# EAGLE design simpleROM (EAGLE 8.1.0)
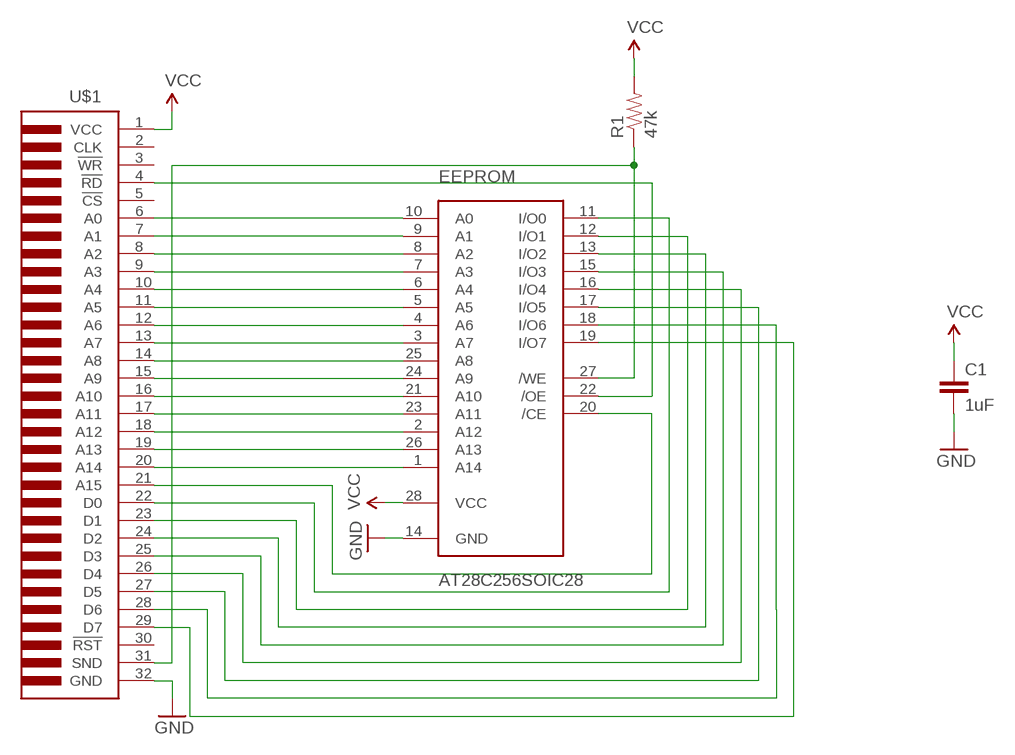
[diagram p0: schematic, sheet 1]

## Parts
C1  1uF  SPARKFUN-CAPACITORS_CAP1206  [SPARKFUN-CAPACITORS_1206]
EEPROM  AT28C256SOIC28  [SO28]
R1  47k  SPARKFUN-RESISTORS_RESISTOR1206  [SPARKFUN-RESISTORS_1206]
U$1  GBCART-FULL  [GBCART]

## Nets
/CE: EEPROM.20(/CE) U$1.21(A15)
/OE: EEPROM.22(/OE) U$1.4(!RD)
/WE: EEPROM.27(/WE) R1.1 U$1.31(SND)
GND: C1.2 EEPROM.14(GND) U$1.32(GND)
N$1: EEPROM.10(A0) U$1.6(A0)
N$2: EEPROM.9(A1) U$1.7(A1)
N$3: EEPROM.8(A2) U$1.8(A2)
N$4: EEPROM.7(A3) U$1.9(A3)
N$5: EEPROM.6(A4) U$1.10(A4)
N$6: EEPROM.5(A5) U$1.11(A5)
N$7: EEPROM.4(A6) U$1.12(A6)
N$8: EEPROM.3(A7) U$1.13(A7)
N$9: EEPROM.25(A8) U$1.14(A8)
N$10: EEPROM.24(A9) U$1.15(A9)
N$11: EEPROM.21(A10) U$1.16(A10)
N$12: EEPROM.23(A11) U$1.17(A11)
N$13: EEPROM.2(A12) U$1.18(A12)
N$14: EEPROM.26(A13) U$1.19(A13)
N$15: EEPROM.1(A14) U$1.20(A14)
N$16: EEPROM.19(I/O7) U$1.29(D7)
N$17: EEPROM.18(I/O6) U$1.28(D6)
N$22: EEPROM.11(I/O0) U$1.22(D0)
N$23: EEPROM.12(I/O1) U$1.23(D1)
N$24: EEPROM.13(I/O2) U$1.24(D2)
N$25: EEPROM.15(I/O3) U$1.25(D3)
N$26: EEPROM.16(I/O4) U$1.26(D4)
N$27: EEPROM.17(I/O5) U$1.27(D5)
VCC: C1.1 EEPROM.28(VCC) R1.2 U$1.1(VCC)
Unconnected: U$1.2(CLK) U$1.3(!WR) U$1.5(!CS) U$1.30(!RST)

## Library data of the parts
C1 = Mega8515_flasher:SPARKFUN-CAPACITORS_CAP: Capacitor Standard 0603 ceramic capacitor, and 0.1" leaded capacitor.
EEPROM = gameboy:AT28C256
R1 = Mega8515_flasher:SPARKFUN-RESISTORS_RESISTOR: Resistor Basic schematic elements and footprints for 0603, 1206, and PTH resistors.
U$1 = gameboy:GBCART

## Net classes
0 default: width 0.152 mm, drill 0.4 mm, clearance 0.152 mm

## Board
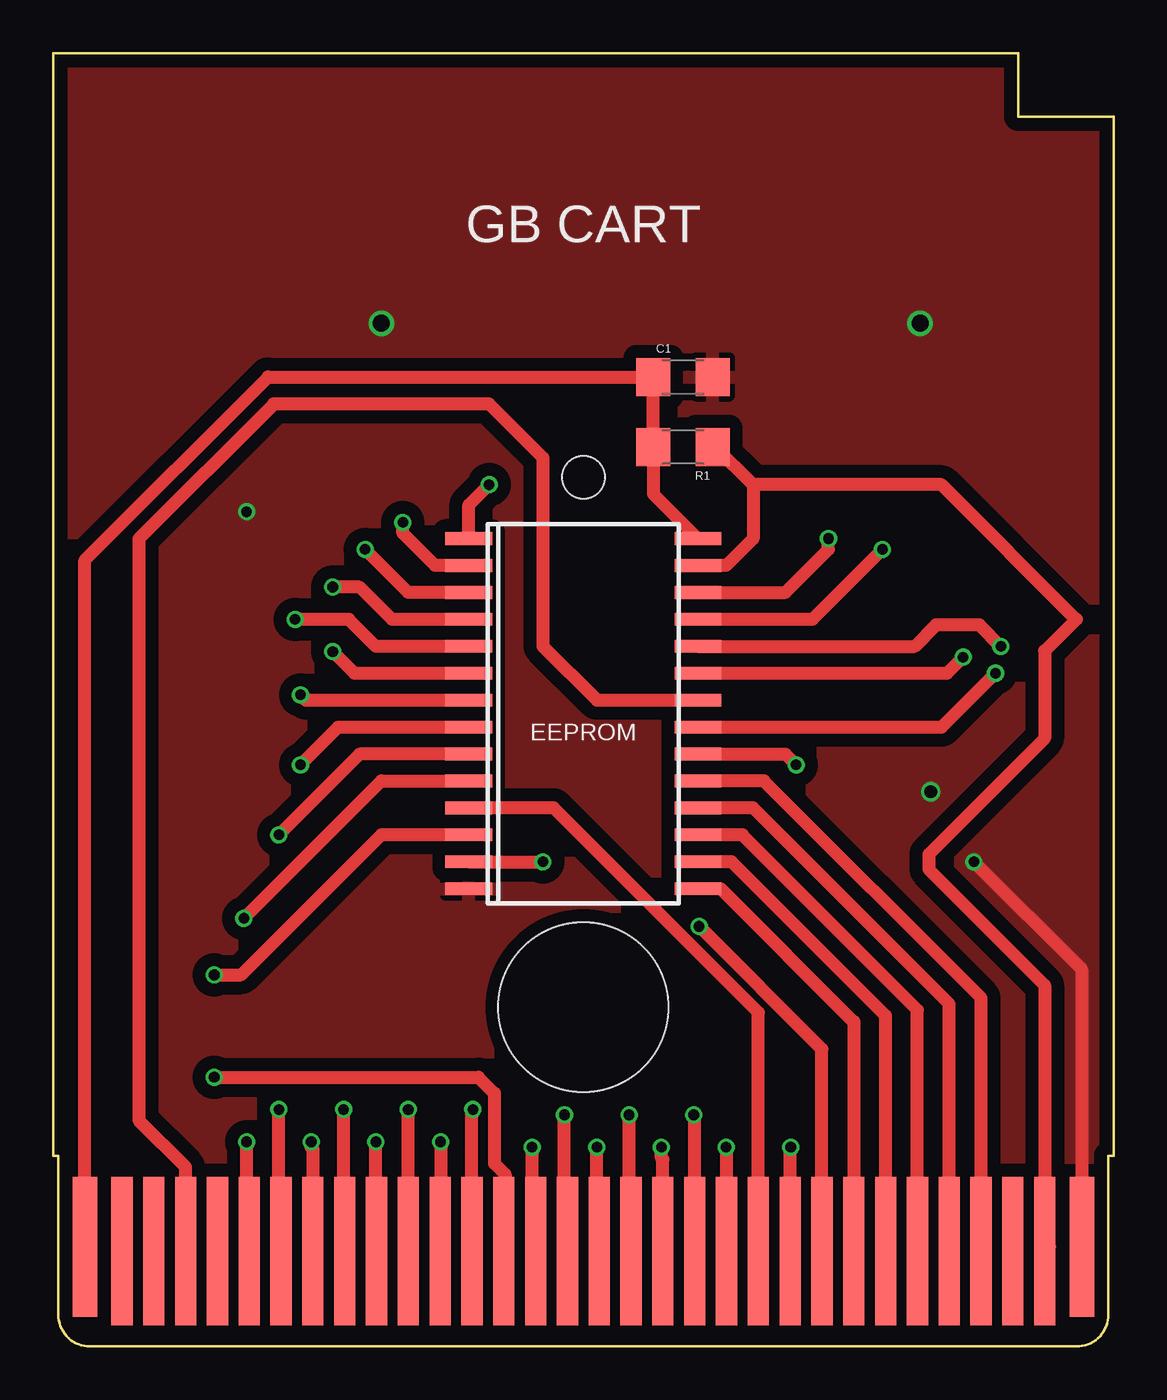
[diagram p1: board, top side]
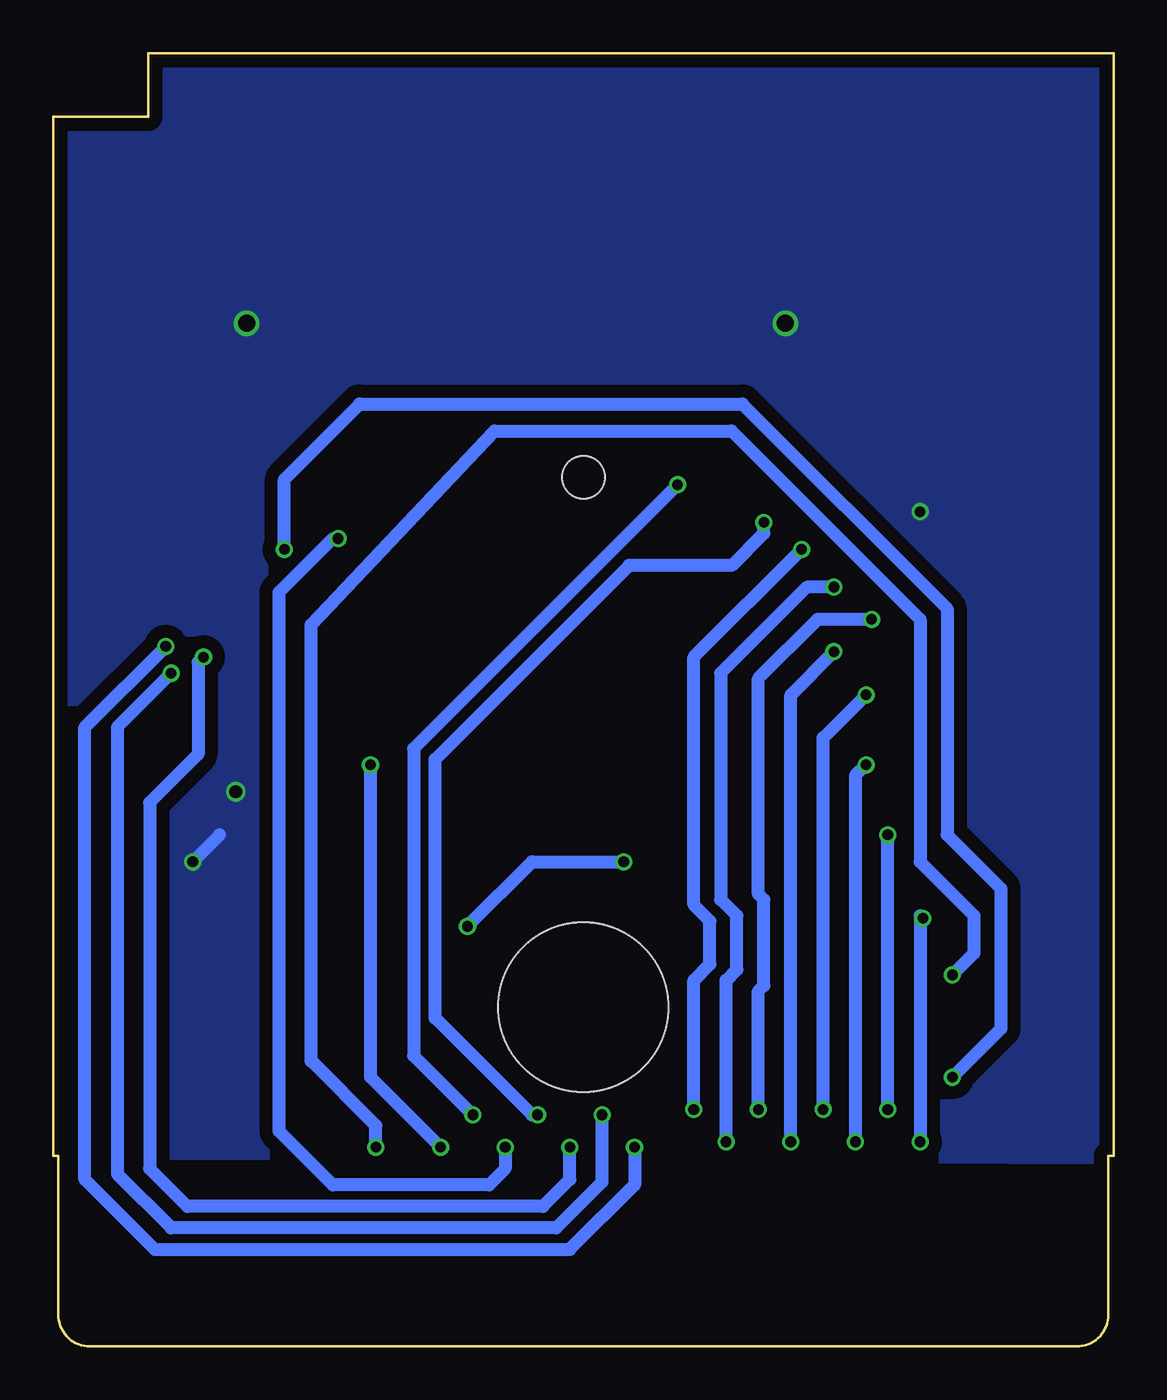
[diagram p2: board, bottom side, seen from below]

Size 50 x 61 mm. Coordinates in mm from the lower left corner, seen from the top.
Copper layers (1*16): Top 0.035mm / dielectric 1.6mm / Bottom 0.035mm
Design rules "Elecrow_2-layer_PCB_eagle_rule": minimum track width 6mil, minimum drill 12mil, track to track 6mil, track to pad 6mil, pad to pad 6mil, via to via 8mil, smd to smd 0mil, copper to edge 20mil, drill to drill 10mil, minimum pad ring 6mil, minimum via ring 6mil, stop-mask expansion 0mil, vias tented up to drill 100mil, thermal gap 10mil

### Footprints (pad centres in the part's own frame; a part is rotated, then mirrored left to right if it is on the bottom)
SPARKFUN-CAPACITORS_1206 = smd 1.6 x 1.8: 1 -1.4,0; 2 1.4,0
SO28 = smd 0.6 x 2.2: 1 -8.255,-5.4; 2 -6.985,-5.4; 3 -5.715,-5.4; 4 -4.445,-5.4; 5 -3.175,-5.4; 6 -1.905,-5.4; 7 -0.635,-5.4; 8 0.635,-5.4; 9 1.905,-5.4; 10 3.175,-5.4; 11 4.445,-5.4; 12 5.715,-5.4; 13 6.985,-5.4; 14 8.255,-5.4; 15 8.255,5.4; 16 6.985,5.4; 17 5.715,5.4; 18 4.445,5.4; 19 3.175,5.4; 20 1.905,5.4; 21 0.635,5.4; 22 -0.635,5.4; 23 -1.905,5.4; 24 -3.175,5.4; 25 -4.445,5.4; 26 -5.715,5.4; 27 -6.985,5.4; 28 -8.255,5.4
SPARKFUN-RESISTORS_1206 = smd 1.6 x 1.8: 1 -1.4,0; 2 1.4,0
GBCART = smd 1.15 x 6.604: 1 -23.5,-24.51; 32 23.5,-24.51 | smd 1 x 7: 2 -21.75,-24.71; 3 -20.25,-24.71; 4 -18.75,-24.71; 5 -17.25,-24.71; 6 -15.75,-24.71; 7 -14.25,-24.71; 8 -12.75,-24.71; 9 -11.25,-24.71; 10 -9.75,-24.71; 11 -8.25,-24.71; 12 -6.75,-24.71; 13 -5.25,-24.71; 14 -3.75,-24.71; 15 -2.25,-24.71; 16 -0.75,-24.71; 17 0.75,-24.71; 18 2.25,-24.71; 19 3.75,-24.71; 20 5.25,-24.71; 21 6.75,-24.71; 22 8.25,-24.71; 23 9.75,-24.71; 24 11.25,-24.71; 25 12.75,-24.71; 26 14.25,-24.71; 27 15.75,-24.71; 28 17.25,-24.71; 29 18.75,-24.71; 30 20.25,-24.71; 31 21.75,-24.71 | hole 8: 0,-13.21 | hole 2: 0,11.79

### Placement (x,y rotation side)
C1  29.7,45.72 0 top
EEPROM  25,29.84 270 top
R1  29.7,42.42 180 top
U$1  25,29.21 0 top

### Tracks (layer width: path | path; a pad name or v marks a point on that pad's centre or on a via)
/CE  (via drill 0.5)
  Top 0.61: U$1.21 31.75,9.38 v31.73,9.4 | EEPROM.20 34.52,27.94 v35.03,27.43
  Bottom 0.61: v31.73,9.4 35.03,12.7 v35.03,27.43
/OE
  Top 0.61: U$1.4 6.25,8.46 4.05,10.67 4.05,38.1 10.4,44.45 20.56,44.45 23.1,41.91 23.1,33.02 25.64,30.48 EEPROM.22
/WE
  Top 0.61: EEPROM.27 31.73,36.83 33,38.1 33,40.64 | R1.1 31.22,42.42 33,40.64 | 46.97,4.72 U$1.31 46.75,17.04 41.29,22.5 41.29,23.22 46.75,28.68 46.75,32.8 48.24,34.29 41.89,40.64 33,40.64
GND  (via drill 0.5, 0.6, 0.8)
  Top 0.61: U$1.32 48.5,4.5 48.5,7.62 48.5,17.78 v43.41,22.86
  Bottom 0.61: v43.41,22.86 42.15,24.13
  other vias: 9.13,39.37 15.48,48.26 40.88,48.26 41.38,26.16
  pour Top (isolate 0.61): 49.77,8.89 -0.02,8.89 -0.02,60.96 49.77,60.96
  pour Bottom (isolate 0.61): 0.24,62.23 50.02,62.48 50.02,9.14 -0.02,8.89
N$1  (via drill 0.5)
  Top 0.61: v9,20.19 15.48,26.67 EEPROM.10 | U$1.6 9.38,4.63 9.13,4.88 v9.13,9.65
  Bottom 0.61: v9,20.19 9.13,20.32 v9.13,9.65
N$2  (via drill 0.5)
  Top 0.61: EEPROM.9 14.46,27.94 v10.65,24.13 | U$1.7 10.65,4.6 v10.65,11.18
  Bottom 0.61: v10.65,11.18 v10.65,24.13
N$3  (via drill 0.5)
  Top 0.61: v11.67,27.43 13.44,29.21 EEPROM.8 | U$1.8 12.25,9.32 12.17,9.4 v12.17,9.65
  Bottom 0.61: v11.67,27.43 12.17,26.92 v12.17,9.65
N$4  (via drill 0.5)
  Top 0.61: U$1.9 13.7,4.55 v13.7,11.18 | v11.67,30.73 11.92,30.48 EEPROM.7
  Bottom 0.61: v13.7,11.18 13.7,28.7 v11.67,30.73
N$5  (via drill 0.5)
  Top 0.61: U$1.10 15.22,4.53 v15.22,9.65 | v13.19,32.77 14.21,31.75 EEPROM.6
  Bottom 0.61: v15.22,9.65 15.22,30.73 v13.19,32.77
N$6  (via drill 0.5)
  Top 0.61: U$1.11 v16.75,11.18 | EEPROM.5 15.22,33.02 13.95,34.29 v11.41,34.29
  Bottom 0.61: v11.41,34.29 13.95,34.29 16.75,31.5 16.75,21.34 16.49,21.08 16.49,17.02 16.75,16.76 v16.75,11.18
N$7  (via drill 0.5)
  Top 0.61: EEPROM.4 15.98,34.29 14.46,35.81 v13.19,35.81 | v18.27,9.65 18.27,4.52 U$1.12
  Bottom 0.61: v13.19,35.81 14.46,35.81 18.52,31.75 18.52,21.08 17.76,20.32 17.76,17.78 18.27,17.27 v18.27,9.65
N$8  (via drill 0.5)
  Top 0.61: EEPROM.3 16.75,35.56 v14.71,37.59 | U$1.13 19.75,10.88 v19.79,11.18
  Bottom 0.61: v14.71,37.59 19.79,32.51 19.79,20.83 19.03,20.07 19.03,18.03 19.79,17.27 v19.79,11.18
N$9  (via drill 0.5)
  Top 0.61: EEPROM.25 35.8,34.29 v39.1,37.59 | U$1.14 21.32,4.57 21.32,8.13 20.81,8.64 20.81,11.94 20.05,12.7 v7.6,12.7
  Bottom 0.61: v7.6,12.7 5.32,14.99 5.32,21.59 7.86,24.13 7.86,34.8 17.51,44.45 35.54,44.45 39.1,40.89 v39.1,37.59
N$10  (via drill 0.5)
  Top 0.61: U$1.15 22.59,5.17 v22.59,9.4 | EEPROM.24 40.62,33.02 41.64,34.04 43.67,34.04 v44.69,33.02
  Bottom 0.61: v22.59,9.4 22.59,7.62 25.64,4.57 45.19,4.57 48.5,7.87 48.5,29.21 v44.69,33.02
N$11  (via drill 0.5)
  Top 0.61: EEPROM.21 41.89,29.21 v44.43,31.75 | U$1.16 24.11,4.64 v24.11,10.92
  Bottom 0.61: v24.11,10.92 24.11,7.76 26.28,5.59 44.43,5.59 46.97,8.13 46.97,29.21 v44.43,31.75
N$12  (via drill 0.5)
  Top 0.61: U$1.17 25.64,4.62 v25.64,9.4 | EEPROM.23 42.15,31.75 v42.91,32.51
  Bottom 0.61: v25.64,9.4 25.64,7.87 26.91,6.6 43.67,6.6 45.45,8.38 45.45,25.65 43.16,27.94 43.16,32.26 v42.91,32.51
N$13  (via drill 0.5)
  Top 0.61: 27.25,10.83 v27.16,10.92 27.16,4.59 U$1.18 | v16.49,38.86 16.49,38.35 18.02,36.83 EEPROM.2
  Bottom 0.61: v16.49,38.86 16.49,38.35 18.02,36.83 22.84,36.83 31.98,27.69 31.98,15.49 27.41,10.92 v27.16,10.92
N$14  (via drill 0.5)
  Top 0.61: U$1.19 28.75,8.82 28.68,8.89 v28.68,9.4 | EEPROM.26 34.52,35.56 36.56,37.59 v36.56,38.1
  Bottom 0.61: v28.68,9.4 28.68,8.38 29.45,7.62 36.81,7.62 39.35,10.16 39.35,35.56 36.81,38.1 v36.56,38.1
N$15  (via drill 0.5)
  Top 0.61: U$1.20 30.25,10.88 v30.21,10.92 | EEPROM.1 19.6,39.69 v20.56,40.64
  Bottom 0.61: v20.56,40.64 33,28.19 33,13.72 v30.21,10.92
N$16
  Top 0.61: U$1.29 43.75,16.43 33.51,26.67 EEPROM.19
N$17
  Top 0.61: U$1.28 42.25,16.15 33,25.4 EEPROM.18
N$22
  Top 0.61: U$1.22 33.26,15.75 23.6,25.4 EEPROM.11
N$23  (via drill 0.5)
  Top 0.61: EEPROM.12 15.48,24.13 8.87,17.53 v7.6,17.53 | U$1.23 34.75,9.12 v34.78,9.4
  Bottom 0.61: v34.78,9.4 34.78,10.41 37.83,13.46 37.83,34.04 29.19,43.18 18.02,43.18 9.13,34.29 9.13,22.86 6.59,20.32 6.59,18.54 v7.6,17.53
N$24  (via drill 0.5)
  Top 0.61: EEPROM.13 v23.1,22.86 | U$1.24 36.25,14.02 v30.46,19.81
  Bottom 0.61: v30.46,19.81 27.41,22.86 v23.1,22.86
N$25
  Top 0.61: U$1.25 37.75,15.32 31.48,21.59 EEPROM.15
N$26
  Top 0.61: U$1.26 39.25,15.6 31.98,22.86 EEPROM.16
N$27
  Top 0.61: U$1.27 40.75,15.87 32.49,24.13 EEPROM.17
VCC
  Top 0.61: 1.51,4.5 U$1.1 1.5,37.08 10.14,45.72 C1.1 R1.2 28.3,40.2 EEPROM.28

### Text on the board
tPlace: GB CART